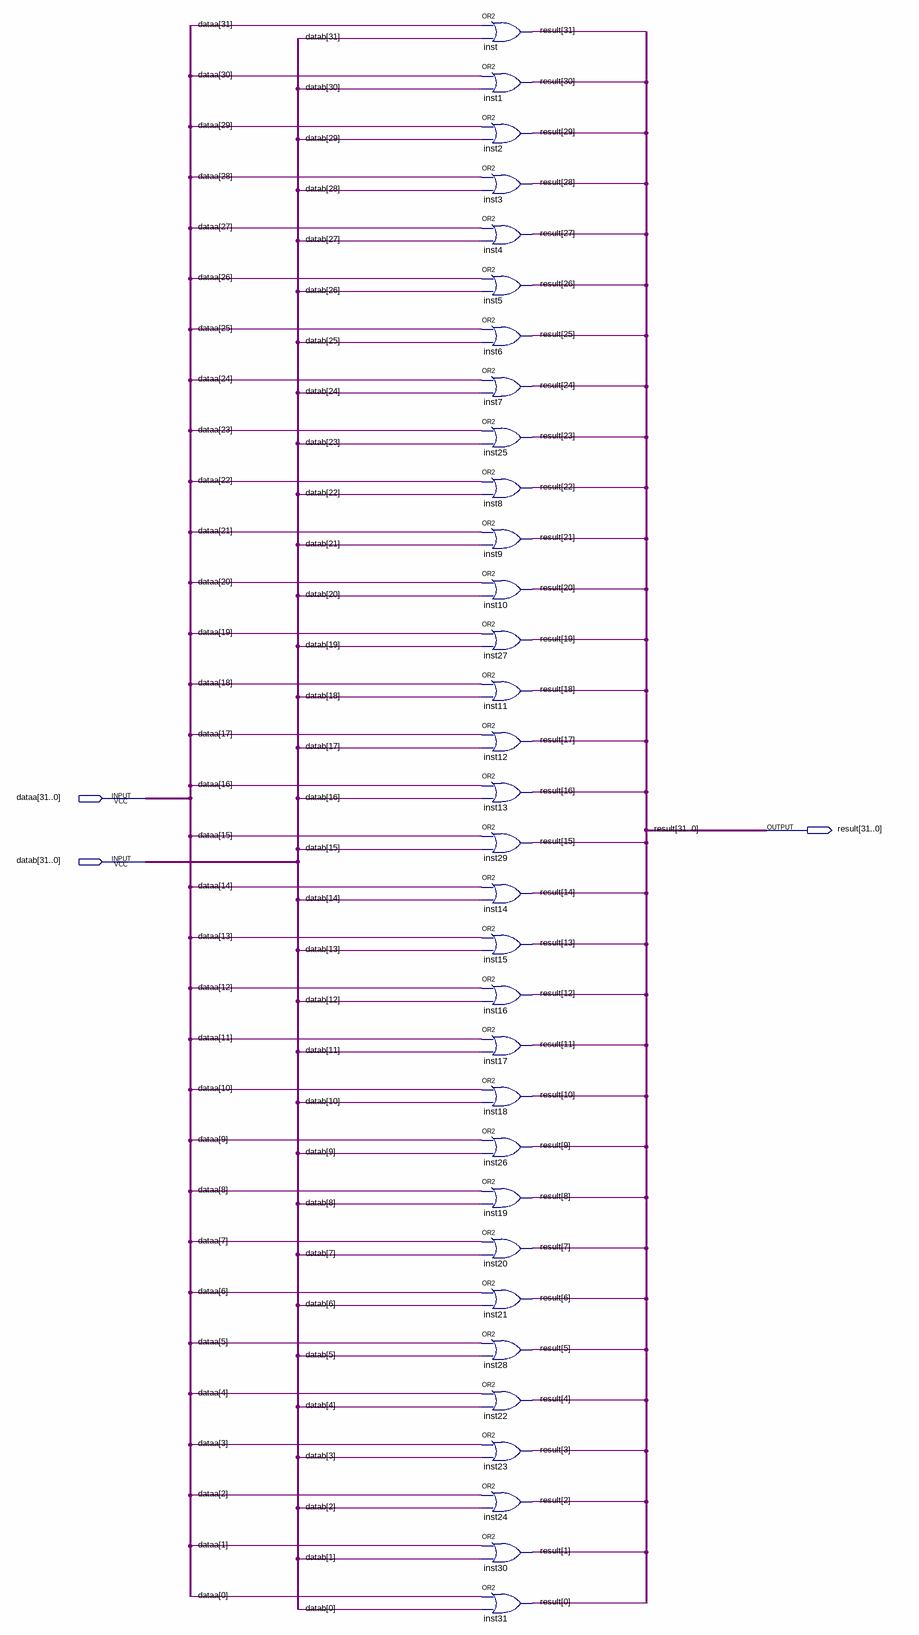
[diagram p0: schematic sheet]
// Quartus schematic ula_or.bdf as structural Verilog: 32 symbols, 3 pins
module ula_or (
  input  [31:0] dataa,
  input  [31:0] datab,
  output [31:0] result
);

  or inst (result[31], dataa[31], datab[31]);
  or inst1 (result[30], dataa[30], datab[30]);
  or inst2 (result[29], dataa[29], datab[29]);
  or inst3 (result[28], dataa[28], datab[28]);
  or inst4 (result[27], dataa[27], datab[27]);
  or inst5 (result[26], dataa[26], datab[26]);
  or inst6 (result[25], dataa[25], datab[25]);
  or inst7 (result[24], dataa[24], datab[24]);
  or inst25 (result[23], dataa[23], datab[23]);
  or inst8 (result[22], dataa[22], datab[22]);
  or inst9 (result[21], dataa[21], datab[21]);
  or inst10 (result[20], dataa[20], datab[20]);
  or inst27 (result[19], dataa[19], datab[19]);
  or inst11 (result[18], dataa[18], datab[18]);
  or inst12 (result[17], dataa[17], datab[17]);
  or inst13 (result[16], dataa[16], datab[16]);
  or inst29 (result[15], dataa[15], datab[15]);
  or inst14 (result[14], dataa[14], datab[14]);
  or inst15 (result[13], dataa[13], datab[13]);
  or inst16 (result[12], dataa[12], datab[12]);
  or inst17 (result[11], dataa[11], datab[11]);
  or inst18 (result[10], dataa[10], datab[10]);
  or inst26 (result[9], dataa[9], datab[9]);
  or inst19 (result[8], dataa[8], datab[8]);
  or inst20 (result[7], dataa[7], datab[7]);
  or inst21 (result[6], dataa[6], datab[6]);
  or inst28 (result[5], dataa[5], datab[5]);
  or inst22 (result[4], dataa[4], datab[4]);
  or inst23 (result[3], dataa[3], datab[3]);
  or inst24 (result[2], dataa[2], datab[2]);
  or inst30 (result[1], dataa[1], datab[1]);
  or inst31 (result[0], dataa[0], datab[0]);
endmodule
